# Altium project ESP8266DevMinBoard.PrjPcb
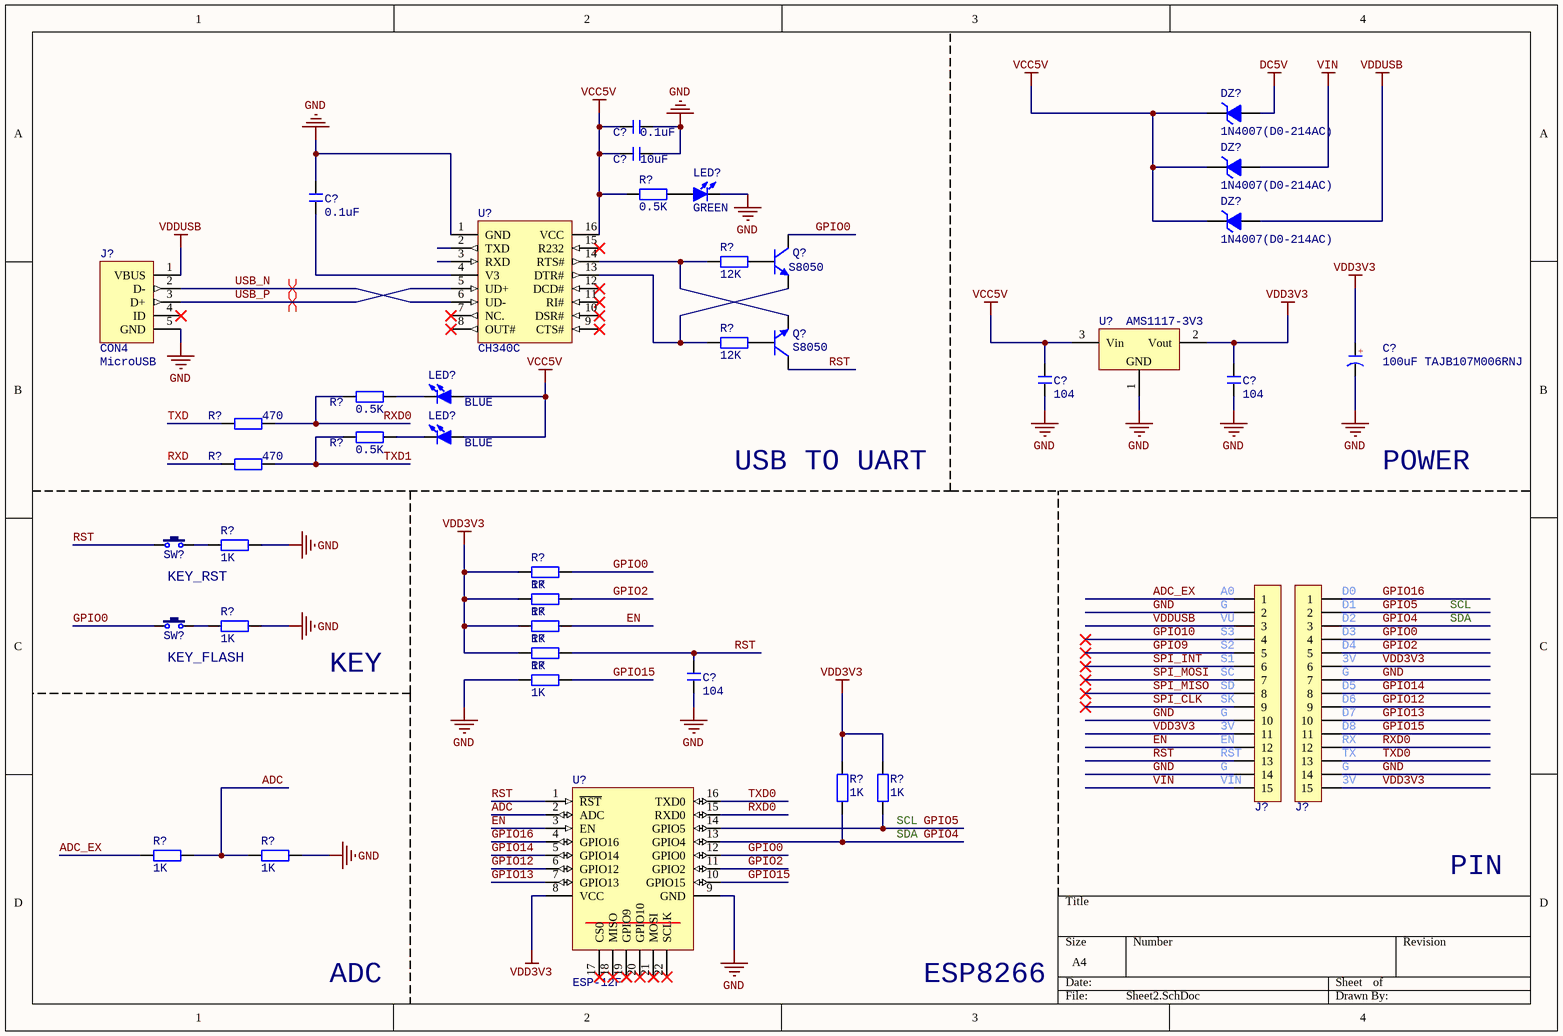
[diagram p0: Sheet2.SchDoc]
1 sheet, 41 parts. Net scope: global (net labels, ports and power ports of the same name join across sheets).
Board file: PCB1.PcbDoc

## Sheet Sheet2.SchDoc
size A4; SheetNumber: 1; SheetTotal: 1

### Parts
(Parts that share a designator on the sheet are numbered #1, #2 ... from top to bottom, then left to right.)
C?#1  0.1uF  [C 0402_M]
C?#2  10uF  [C 0402_M]
C?#3  0.1uF  [C 0402_M]
C?#4  100uF TAJB107M006RNJ  [CM A(3*5.4)]
C?#5  104  [C 0402_M]
C?#6  104  [C 0402_M]
C?#7  104  [C 0402_M]
DZ?#1  1N4007(D0-214AC)  [D SMA(DO-214AC)]
DZ?#2  1N4007(D0-214AC)  [D SMA(DO-214AC)]
DZ?#3  1N4007(D0-214AC)  [D SMA(DO-214AC)]
J?#1  CON4  [MicroUsb_C404969]
J?#2  HDR-1X15  [PH2.0-WS-15P]  (value not drawn)
J?#3  HDR-1X15  [PH2.0-WS-15P]  (value not drawn)
LED?#1  GREEN  [D 0402]
LED?#2  BLUE  [D 0402]
LED?#3  BLUE  [D 0402]
Q?#1  S8050  [Q SOT23-3L]
Q?#2  S8050  [Q SOT23-3L]
R?#1  0.5K  [R 0603C]
R?#2  12K  [R 0402R]
R?#3  12K  [R 0402R]
R?#4  0.5K  [R 0603C]
R?#5  470  [R 0402R]
R?#6  0.5K  [R 0603C]
R?#7  470  [R 0402R]
R?#8  1K  [R 0603C]
R?#9  1K  [R 0603C]
R?#10  1K  [R 0603C]
R?#11  1K  [R 0603C]
R?#12  1K  [R 0603C]
R?#13  1K  [R 0603C]
R?#14  1K  [R 0603C]
R?#15  1K  [R 0603C]
R?#16  1K  [R 0603C]
R?#17  1K  [R 0603C]
R?#18  1K  [R 0603C]
SW?#1  3x6x5  [TSW DIP-3*6*4.3]  (value not drawn)
SW?#2  3x6x5  [TSW DIP-3*6*4.3]  (value not drawn)
U?#1  CH340C  [SOP-16_150mil]
U?#2  AMS1117-3V3  [SOT223_L]
U?#3  ESP-12F  [ESP-12F]

### Nets
3V: C?#4.1(A) C?#6.2 J?#2.11 J?#3.6 J?#3.15 R?#9.1 R?#10.1 R?#12.1 R?#13.1 R?#15.1 R?#16.1 U?#2.2(Vout) U?#3.8(VCC)  [also labelled VDD3V3]
DC5V: DZ?#1.1(A)
G: C?#1.2 C?#2.2 C?#3.2 C?#4.2(K) C?#5.1 C?#6.1 C?#7.1 J?#1.5(GND) J?#2.2 J?#2.10 J?#2.14 J?#3.7 J?#3.14 LED?#1.2(K) R?#8.2 R?#11.2 R?#14.1 R?#18.2 U?#1.1(GND) U?#2.1(GND) U?#3.9(GND)  [also labelled GND]
VCC5V: C?#1.1 C?#2.1 C?#5.2 DZ?#1.2(K) DZ?#2.2(K) DZ?#3.2(K) LED?#2.1(A) LED?#3.1(A) R?#1.1 U?#1.16(VCC) U?#2.3(Vin)
VDDUSB: DZ?#3.1(A) J?#1.1(VBUS) J?#2.3  [also labelled VU]
VIN: DZ?#2.1(A) J?#2.15
A0: J?#2.1 R?#17.2  [also labelled ADC_EX]
ADC: R?#17.1 R?#18.1 U?#3.2(ADC)
D0: J?#3.1 U?#3.4(GPIO16)  [also labelled GPIO16]
D1: J?#3.2 R?#16.2 U?#3.14(GPIO5)  [also labelled GPIO5, SCL]
D2: J?#3.3 R?#15.2 U?#3.13(GPIO4)  [also labelled GPIO4, SDA]
D3: J?#3.4 Q?#1.3(C) R?#9.2 SW?#2.1 U?#3.12(GPIO0)  [also labelled GPIO0]
D4: J?#3.5 R?#10.2 U?#3.11(GPIO2)  [also labelled GPIO2]
D5: J?#3.8 U?#3.5(GPIO14)  [also labelled GPIO14]
D6: J?#3.9 U?#3.6(GPIO12)  [also labelled GPIO12]
D7: J?#3.10 U?#3.7(GPIO13)  [also labelled GPIO13]
D8: J?#3.11 R?#14.2 U?#3.10(GPIO15)  [also labelled GPIO15]
EN: J?#2.12 R?#12.2 U?#3.3(EN)
GPIO9: J?#2.5  [also labelled S2]
GPIO10: J?#2.4  [also labelled S3]
RST: C?#7.2 J?#2.13 Q?#2.3(C) R?#13.2 SW?#1.1 U?#3.1(~{RST})
RX: J?#3.12 R?#4.1 R?#5.2 U?#3.15(RXD0)  [also labelled RXD0]
RXD: R?#7.1
S1: J?#2.6  [also labelled SPI_INT]
SC: J?#2.7  [also labelled SPI_MOSI]
SD: J?#2.8  [also labelled SPI_MISO]
SK: J?#2.9  [also labelled SPI_CLK]
TX: J?#3.13 U?#3.16(TXD0)  [also labelled TXD0]
TXD: R?#5.1
TXD1: R?#6.1 R?#7.2
USB_N: J?#1.2(D-) U?#1.6(UD-)
USB_P: J?#1.3(D+) U?#1.5(UD+)
NetC?#3_1: C?#3.1 U?#1.4(V3)
NetLED?#1_1: LED?#1.1(A) R?#1.2
NetLED?#2_2: LED?#2.2(K) R?#4.2
NetLED?#3_2: LED?#3.2(K) R?#6.2
NetQ?#1_1: Q?#1.1(B) R?#2.2
NetQ?#1_2: Q?#1.2(E) R?#3.1 U?#1.13(DTR#)
NetQ?#2_1: Q?#2.1(B) R?#3.2
NetQ?#2_2: Q?#2.2(E) R?#2.1 U?#1.14(RTS#)
NetR?#8_1: R?#8.1 SW?#1.2
NetR?#11_1: R?#11.1 SW?#2.2

Not connected (* = marked no-connect by the designer): J?#1 4(ID)*; U?#1 2(TXD) 3(RXD) 7(NC.)* 8(OUT#)* 9(CTS#)* 10(DSR#)* 11(RI#)* 12(DCD#)* 15(R232)*; U?#3 17(CS0)* 18(MISO)* 19(GPIO9)* 20(GPIO10)* 21(MOSI)* 22(SCLK)*

### Layout directives
differential pair: USB_N, USB_P

### Notes on the sheet
- (near J?#1) MicroUSB
- USB TO UART
- POWER
- KEY_RST
- KEY_FLASH
- KEY
- PIN
- ADC
- ESP8266
- (in symbol C-CM) +

### Library data of the parts
C?#1-C?#3 C?#5-C?#7 = C: 无极性贴片电容; 版权归属: 源创客; BOM名称: 无极性贴片电容; 学习资源: www.ooocke.com
C?#4 = C-CM: 贴片电解电容; 版权归属: 源创客; BOM名称: 贴片电解电容; 学习资源: www.ooocke.com
DZ?#1-DZ?#3 = DZ: 稳压二极管; BOM名称: 3V/0.5W稳压管; 版权归属: 源创客; 学习资源: www.ooocke.com
J?#1 = MicroUSB_5P
J?#2 J?#3 = Header 15: 15P接插件; 版权归属: 源创客; BOM名称: 15P接插件; 学习资源: www.ooocke.com
LED?#1-LED?#3 = LED-SMD: 贴片LED; 版权归属: 源创客; BOM名称: 贴片LED; 学习资源: www.ooocke.com
Q?#1 Q?#2 = Q NPN: 互补功率-NPN型; 版权归属: 源创客; 属性: 80V 8A 50W; BOM名称: 互补功率-NPN型; 学习资源: www.ooocke.com
R?#1-R?#18 = R: 贴片电阻
SW?#1 SW?#2 = TSW 3x6: 3x6轻触开关; 版权归属: 源创客; BOM名称: 3x6轻触开关; 学习资源: www.ooocke.com
U?#1 = CH340C: CH340 是一个 USB 总线的转接芯片，实现 USB 转串口或者 USB 转打印口。
U?#2 = AMS1117: 三端稳压芯片; BOM名称: 稳压芯片; 版权归属: 源创客; 学习资源: www.ooocke.com
U?#3 = ESP8266-12F: ESP-12F 是由安信可科技开发的 Wi-Fi 模块， 该模块核心处理器 ESP8266 在较小尺 / 寸封装中集成了业界领先的 Tensilica L106 超低功耗 32 位微型 MCU， 带有 16 位精 / 简模式， 主频支持 80 MHz 和 160 MHz， 支持 RTOS， 集成 Wi-Fi MAC/ BB/RF/PA/LNA。 / ESP-12F Wi-Fi 模块支持标准的 IEEE802.11 b/g/n 协议， 完整的 TCP/IP 协议栈。 / 用户可以使用该模块为现有的设备添加联网功能， 也可以构建独立的网络控制器。 / ESP8266 是高性能无线 SoC， 以最低成本提供最大实用性， 为 Wi-Fi 功能嵌入其他 / 系统提供无限可能。